# EAGLE design UKHASnetLPC (EAGLE 6.5.0)
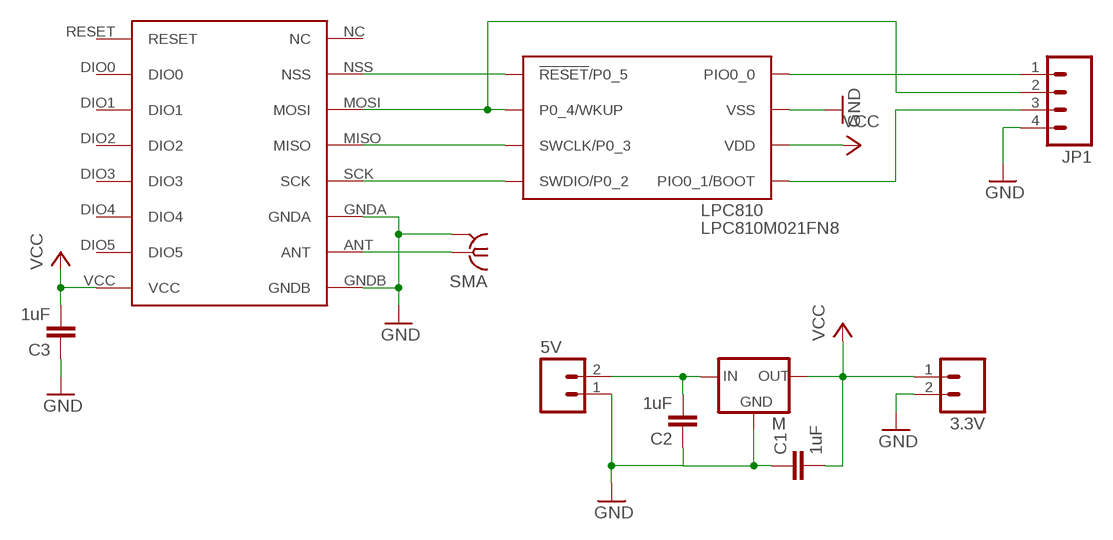
[diagram p0: schematic, sheet 1]

## Parts
3.3V  M02LOCK  [1X02_LOCK]
5V  M02LOCK  [1X02_LOCK]
C1  1uF  CAPPTH  [CAP-PTH-SMALL]
C2  1uF  CAPPTH  [CAP-PTH-SMALL]
C3  1uF  CAPPTH  [CAP-PTH-SMALL]
JP1  M04PTH  [1X04]
LPC810  LPC810M021FN8  [DIP8]
M  MCP1700INLINE  [TO92-INLINE]
RFM69  RFM69HW  [RFM]
SMA  BUS-SMA  [BUS-SMA]

## Nets
GND: 3.3V.2 5V.1 C1.1 C2.1 C3.1 JP1.4 LPC810.P$7(VSS) M.1(GND) RFM69.GNDA RFM69.GNDB SMA.2(GND) SMA.3(GND) SMA.4(GND) SMA.5(GND)
N$1: LPC810.P$1(!RESET!/P0_5) RFM69.NSS
N$2: JP1.2 LPC810.P$2(P0_4/WKUP) RFM69.MOSI
N$3: LPC810.P$3(SWCLK/P0_3) RFM69.MISO
N$4: LPC810.P$4(SWDIO/P0_2) RFM69.SCK
N$6: JP1.3 LPC810.P$5(PIO0_1/BOOT)
N$7: JP1.1 LPC810.P$8(PIO0_0)
N$10: RFM69.ANT SMA.1
N$11: 5V.2 C2.2 M.2(IN)
VCC: 3.3V.1 C1.2 C3.2 LPC810.P$6(VDD) M.3(OUT) RFM69.VCC
Unconnected: RFM69.DIO0 RFM69.DIO1 RFM69.DIO2 RFM69.DIO3 RFM69.DIO4 RFM69.DIO5 RFM69.NC RFM69.RESET

## Library data of the parts
3.3V 5V = SparkFun-Connectors:M02: Header 2 Standard 2-pin 0.1" header. Use with straight break away headers (SKU : PRT-00116), right angle break away headers (PRT-00553), swiss pins (PRT-00743), machine pins (PRT-00117), and female headers (PRT-00115). Molex polarized connector foot print use with SKU : PRT-08233 with associated crimp pins and housings.
C1-C3 = SparkFun-Capacitors:CAP: Capacitor Standard 0603 ceramic capacitor, and 0.1" leaded capacitor.
JP1 = SparkFun-Connectors:M04: Header 4 Standard 4-pin 0.1" header. Use with straight break away headers (SKU : PRT-00116), right angle break away headers (PRT-00553), swiss pins (PRT-00743), machine pins (PRT-00117), and female headers (PRT-00115). Molex polarized connector foot print use with SKU : PRT-08231 with associated crimp pins and housings. 1MM SMD Version SKU: PRT-10208
LPC810 = carrilib:LPC810
M = adafruit:MCP1700: VOLTAGE REGULATOR
RFM69 = hopeRF2:RFM69HW
SMA = Ava:BUS-SMA

## Board
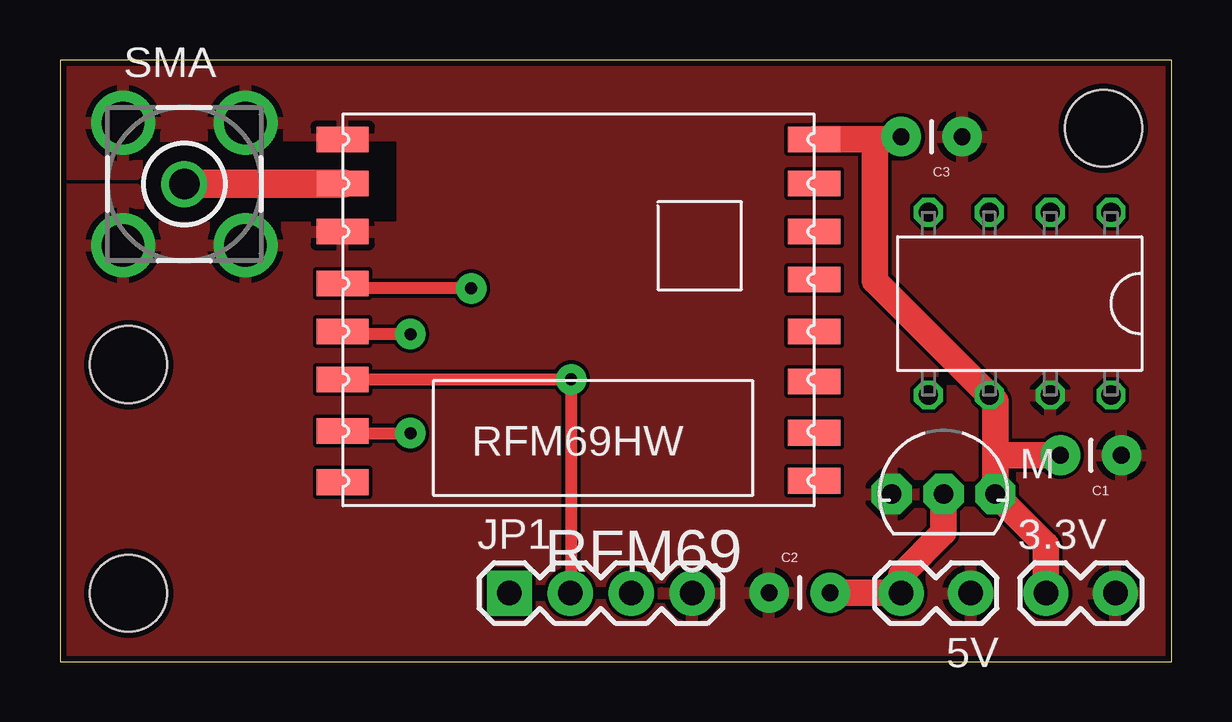
[diagram p1: board, top side]
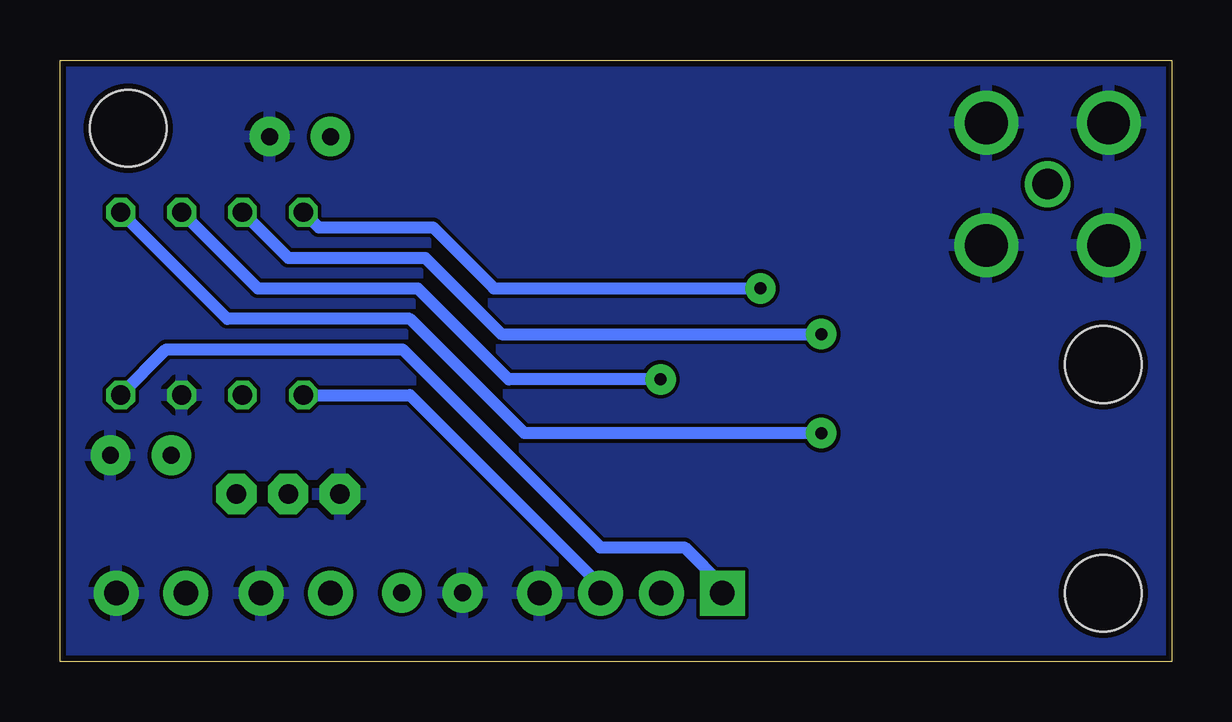
[diagram p2: board, bottom side, seen from below]

Size 46.34 x 25.07 mm. Coordinates in mm from the lower left corner, seen from the top.
Outline: 0,0 46.34,0 46.34,25.07 0,25.07 0,0
Copper layers (1*2*15*16): Top 0.035mm / dielectric 0.2mm / layer 2 0.0175mm / dielectric 1.1mm / layer 15 0.0175mm / dielectric 0.2mm / Bottom 0.035mm
Design rules "SeeedStudio_DRU_no_angle_20130527": minimum track width 6mil, minimum drill 12mil, track to track 6mil, track to pad 6mil, pad to pad 6mil, via to via 6mil, smd to smd 0mil, copper to edge 10mil, drill to drill 10mil, minimum pad ring 6mil, minimum via ring 6mil, stop-mask expansion 2mil, vias tented up to drill 25mil, thermal gap 10mil
Holes 3.2 mm at 43.5,22.23 2.86,12.38 2.86,2.86

### Footprints (pad centres in the part's own frame; a part is rotated, then mirrored left to right if it is on the bottom)
1X02_LOCK = drill 1.016 pad 1.88: 1 -0.178,0; 2 2.718,0
CAP-PTH-SMALL = drill 0.7 pad 1.651: 1 0,0; 2 2.54,0
1X04 = drill 1.016 pad 1.88 square: 1 0,0 | drill 1.016 pad 1.88: 2 2.54,0; 3 5.08,0; 4 7.62,0
DIP8 = drill 0.8 octagon: P$1 -3.81,3.81; P$2 -3.81,1.27; P$3 -3.81,-1.27; P$4 -3.81,-3.81; P$5 3.81,-3.81; P$6 3.81,-1.27; P$7 3.81,1.27; P$8 3.81,3.81
TO92-INLINE = drill 0.813 pad 1.676 octagon: 1 -2.159,0; 2 0,0; 3 2.159,0
RFM = smd 2.184 x 1.067: ANT 19.651,2.889; DIO0 0,13.27; DIO1 0,11.143; DIO2 0,9.047; DIO3 0,6.889; DIO4 0,4.889; DIO5 0,2.889; GNDA 19.651,4.889; GNDB 19.651,1.048; MISO 19.651,9.047; MOSI 19.651,11.047; NC 19.651,15.334; NSS 19.651,13.206; RESET 0,15.27; SCK 19.651,7.048; VCC 0,1.048
BUS-SMA = drill 1.27: 1 0,0 | drill 1.778: 2 -2.55,2.55; 3 2.55,2.55; 4 2.55,-2.55; 5 -2.55,-2.55

### Placement (x,y rotation side)
3.3V  41.27,2.86 0 top
5V  37.78,2.86 180 top
C1  44.24,8.6 180 top
C2  29.56,2.87 0 top
C3  37.6,21.88 180 top
JP1  18.73,2.86 0 top
LPC810  40.01,14.92 270 top
M  36.83,6.99 0 top
RFM69  31.43,22.81 180 top
SMA  5.18,19.9 0 top

### Tracks (layer width: path | path; a pad name or v marks a point on that pad's centre or on a via)
GND
  pour Top: 0,25.08 46.35,25.08 46.35,0 0,0 0,19.68 3.17,19.68 arc90 4.76,18.1 14.29,18.1 14.29,21.91 4.76,21.91 arc90 3.17,20.32 0,20.32
  pour Bottom: 0,25.08 46.35,25.08 46.35,0 0.02,0
N$1  (via drill 0.5 pad 1.27)
  Top 0.5: RFM69.NSS 11.86,9.53 v14.61,9.53
  Bottom 0.5: v14.61,9.53 26.99,9.53 31.75,14.29 39.37,14.29 LPC810.P$1
N$2  (via drill 0.5 pad 1.27)
  Top 0.5: RFM69.MOSI v21.31,11.77 21.31,2.9 JP1.2
  Bottom 0.5: LPC810.P$2 38.1,15.56 31.43,15.56 27.64,11.77 v21.31,11.77
N$3  (via drill 0.5 pad 1.27)
  Top 0.5: v14.61,13.65 11.89,13.65 RFM69.MISO
  Bottom 0.5: LPC810.P$3 36.83,16.83 31.11,16.83 27.94,13.65 v14.61,13.65
N$4  (via drill 0.5 pad 1.27)
  Top 0.5: v17.14,15.56 11.99,15.56 RFM69.SCK
  Bottom 0.5: LPC810.P$4 35.56,18.1 30.8,18.1 28.26,15.56 v17.14,15.56
N$6
  Bottom 0.5: LPC810.P$5 31.75,11.11 23.81,3.17 JP1.3
N$7
  Bottom 0.5: LPC810.P$8 41.91,13.02 32.07,13.02 23.81,4.76 20.32,4.76 18.73,3.17 JP1.1
N$10
  Top 1.2: RFM69.ANT SMA.1
N$11
  Top 1.1: M.2 36.83,5.4 35.06,3.63 5V.2 35.05,2.87 C2.2
VCC
  Top 1.1: RFM69.VCC 33.97,21.77 | 33.97,21.77 34.95,21.77 C3.2 | 38.99,8.6 M.3 41.1,4.88 3.3V.1 | 33.97,21.77 33.97,15.88 LPC810.P$6 38.99,10.86 38.99,8.7 38.99,8.6 | C1.2 38.99,8.6

### Text on the board
tDocu: UKHASnet | v0.1